# Altium schematic sheet CriticalBoards.SchDoc
size A
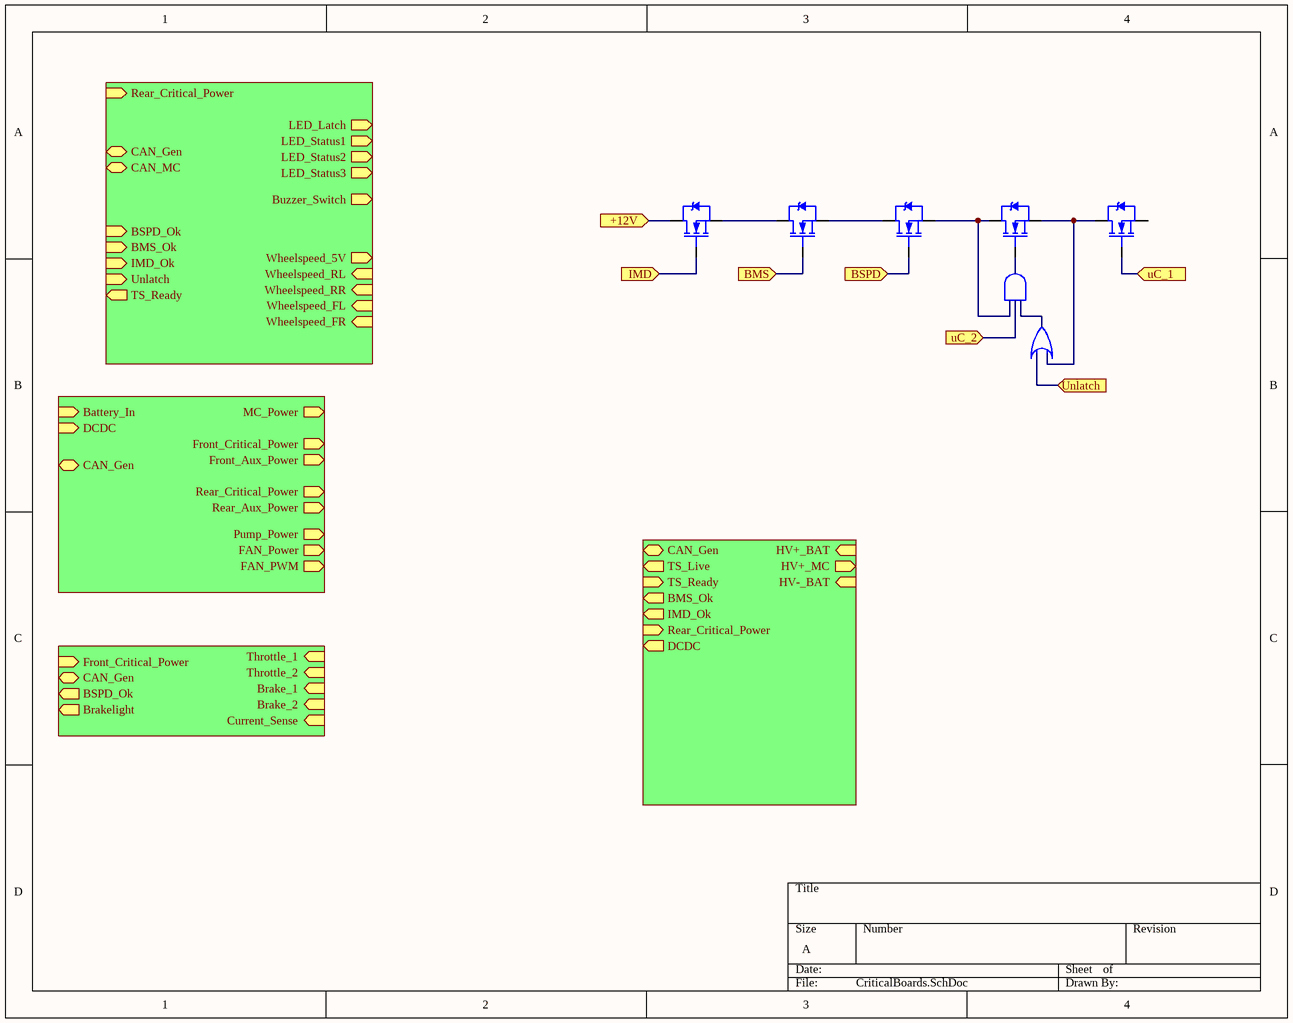
[diagram p0: CriticalBoards.SchDoc]

## Parts
(Parts that share a designator on the sheet are numbered #1, #2 ... from top to bottom, then left to right.)
M?#1  PSMN2R2-25YLC  [POWER-SO8]  (value not drawn)
M?#2  PSMN2R2-25YLC  [POWER-SO8]  (value not drawn)
M?#3  PSMN2R2-25YLC  [POWER-SO8]  (value not drawn)
M?#4  PSMN2R2-25YLC  [POWER-SO8]  (value not drawn)
M?#5  PSMN2R2-25YLC  [POWER-SO8]  (value not drawn)

## Sub-sheets
? = ?: CAN_Gen (bidir), CAN_MC (bidir), Wheelspeed_FR (in), Wheelspeed_FL (in), Wheelspeed_RR (in), Wheelspeed_RL (in), BSPD_Ok (in), LED_Latch (out), LED_Status1 (out), LED_Status2 (out), LED_Status3 (out), BMS_Ok (in), IMD_Ok (in), Unlatch (in), Buzzer_Switch (out), TS_Ready (out), Rear_Critical_Power (in), Wheelspeed_5V (out)
? = ?: CAN_Gen (bidir), FAN_PWM (out), FAN_Power (out), MC_Power (out), Pump_Power (out), Rear_Critical_Power (out), Rear_Aux_Power (out), Battery_In (in), DCDC (in), Front_Critical_Power (out), Front_Aux_Power (out)
? = ?: Front_Critical_Power (in), CAN_Gen (bidir), BSPD_Ok (out), Brakelight (out), Throttle_1 (in), Throttle_2 (in), Brake_1 (in), Brake_2 (in), Current_Sense (in)
? = ?: HV+_BAT (in), HV+_MC (out), HV-_BAT (in), CAN_Gen (bidir), TS_Live (out), TS_Ready (in), Rear_Critical_Power (in), DCDC (out), BMS_Ok (out), IMD_Ok (out)

## Ports
+12V (in), BMS (in), BSPD (in), IMD (in), uC_1 (in), uC_2 (in), Unlatch (in)

## Nets
+12V: M?#1.D(Drain) ; port +12V
BMS: M?#2.G(Gate) ; port BMS
BSPD: M?#3.G(Gate) ; port BSPD
IMD: M?#1.G(Gate) ; port IMD
uC_1: M?#5.G(Gate) ; port uC_1
NetM?#1_S: M?#1.S(Source) M?#2.D(Drain)
NetM?#2_S: M?#2.S(Source) M?#3.D(Drain)
NetM?#3_S: M?#3.S(Source) M?#4.D(Drain)
NetM?#4_S: M?#4.S(Source) M?#5.D(Drain)

Not connected (* = marked no-connect by the designer): M?#4 G(Gate); M?#5 S(Source)

## Library data of the parts
M?#1-M?#5 = 3: N-Channel 25V 100A (Tc) 106W (Tc) Surface Mount LFPAK56, Power-SO8; id: 3; vdsmax: 0; numcircuits: 1; rdson: 2.5mOhm; vt: 4.5; vgsmax: 20; MfrPartNo: *; name: PSMN2R2-25YLC; type: N_Channel; current: 100A; package: LFPAK56; quantity: 0; link: https://www.digikey.com/product-detail/en/nexperia-usa-inc/PSMN2R2-25YLC115/1727-5299-1-ND/2674299